# Altium schematic sheet Analog.SchDoc
size B
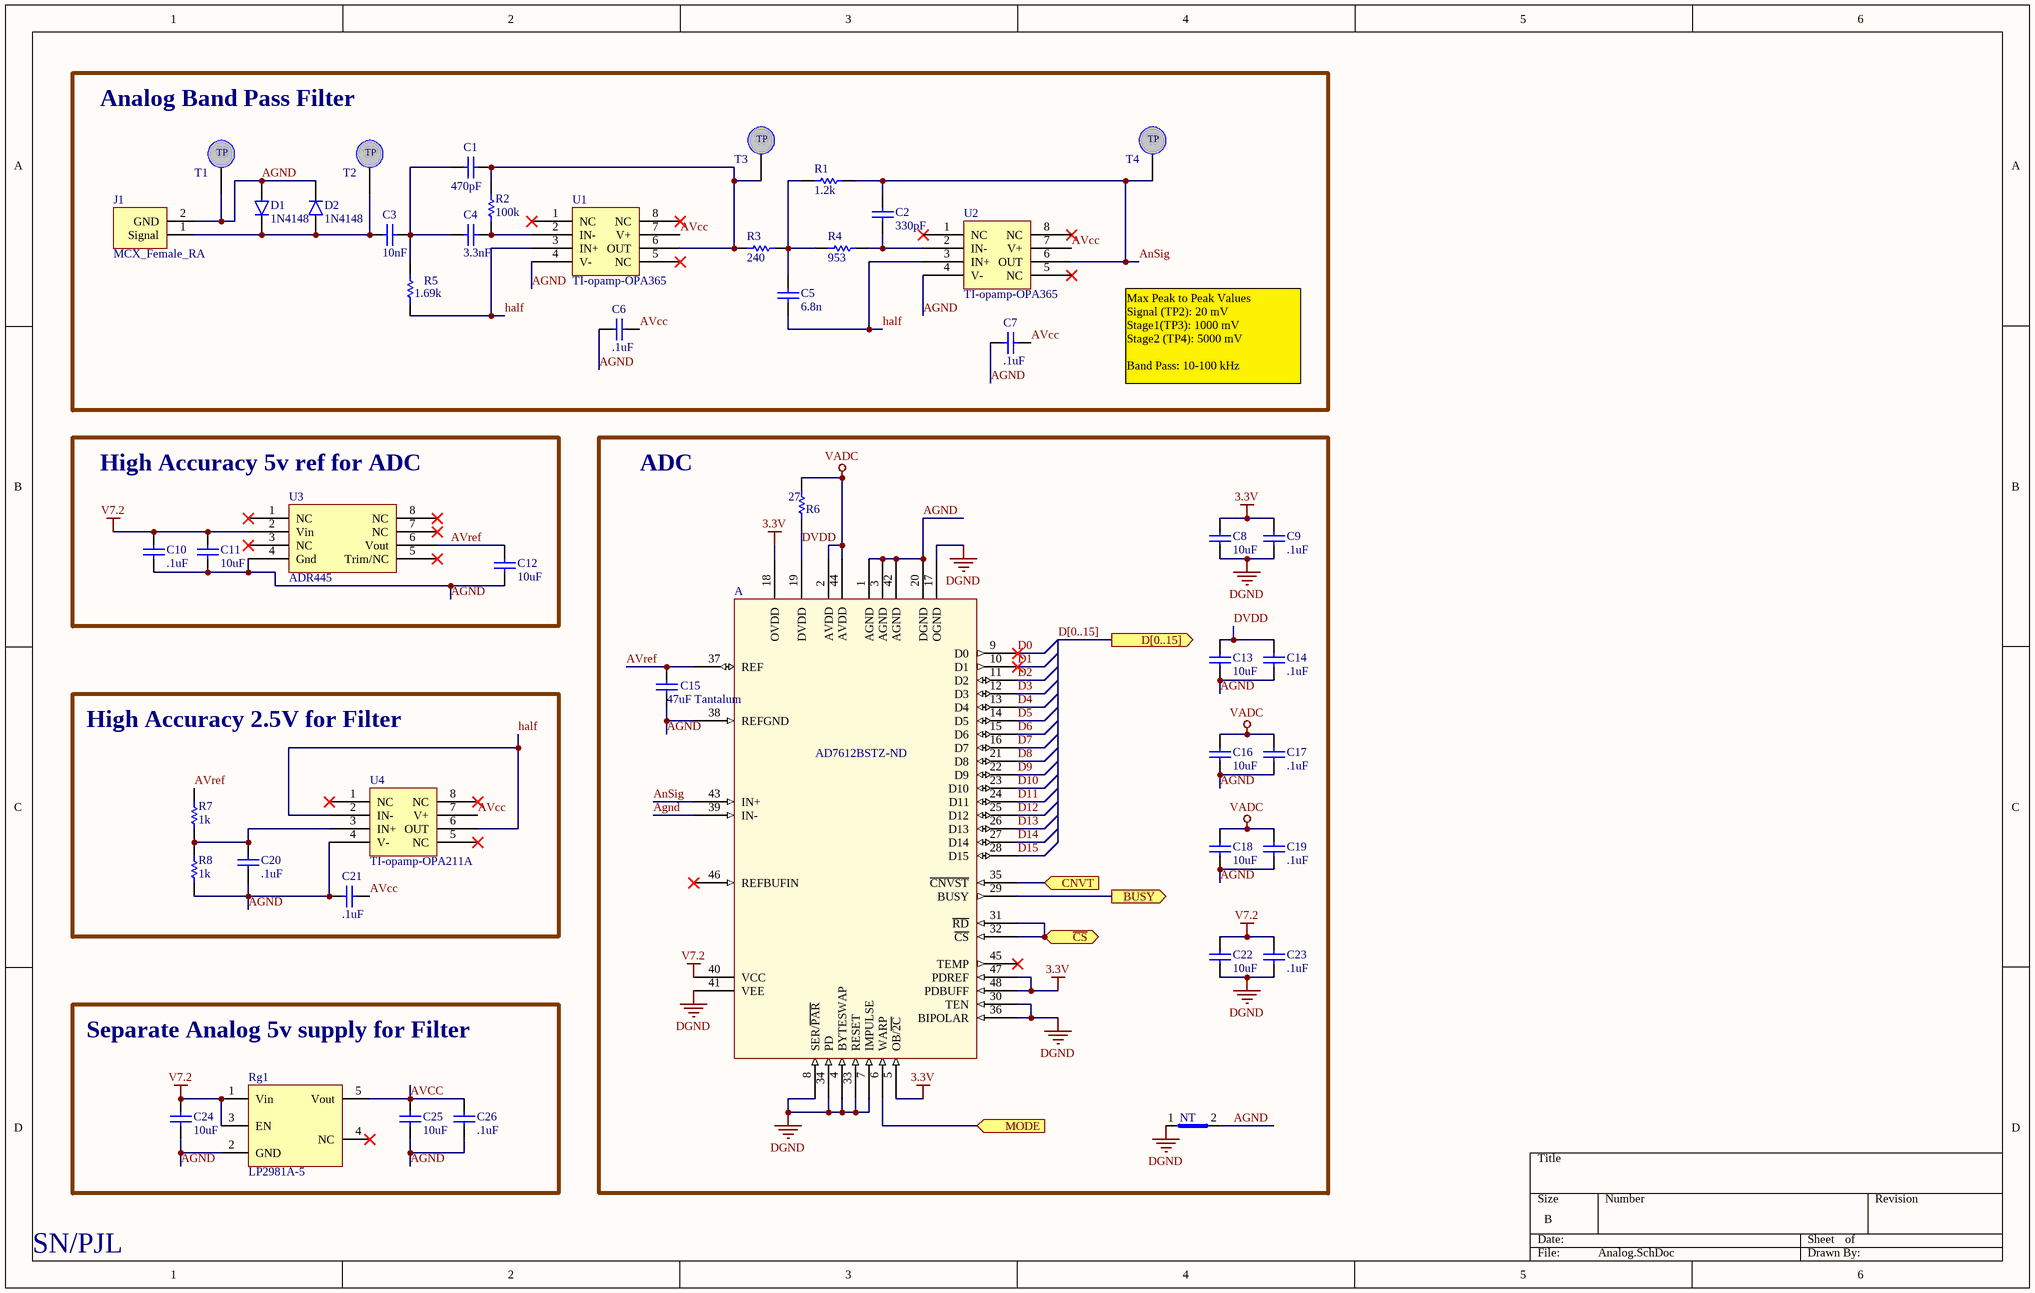
[diagram p0: Analog.SchDoc]

## Parts
A  Supplier Part Number: AD7612BSTZ-ND  [LQFP-48N - ADC]  (hidden comment: AD7612)
C1  470pF  [CAPC2012XN]
C2  330pF  [CAPC2012XN]
C3  10nF  [CAPC2012XN]
C4  3.3nF  [CAPC2012XN]
C5  6.8n  [CAPC2012XN]
C6  .1uF  [CAPC1608XN]
C7  .1uF  [CAPC1608XN]
C8  10uF  [CAPC2012XL]
C9  .1uF  [CAPC1608XN]
C10  .1uF  [CAPC1608XN]
C11  10uF  [CAPC2012XL]
C12  10uF  [CAPC2012XL]
C13  10uF  [CAPC2012XL]
C14  .1uF  [CAPC1608XN]
C15  47uF Tantalum  [CAPC2012XL]
C16  10uF  [CAPC2012XL]
C17  .1uF  [CAPC1608XN]
C18  10uF  [CAPC2012XL]
C19  .1uF  [CAPC1608XN]
C20  .1uF  [CAPC1608XN]
C21  .1uF  [CAPC1608XN]
C22  10uF  [CAPC2012XL]
C23  .1uF  [CAPC1608XN]
C24  10uF  [CAPC2012XL]
C25  10uF  [CAPC2012XL]
C26  .1uF  [CAPC1608XN]
D1  1N4148  [MCC-SOD123]
D2  1N4148  [MCC-SOD123]
J1  MCX_Female_RA  [MCX_Female]
NT  Net Tie SMT  [NetTie 35 mil]  (value not drawn)  (net tie, no BOM)
R1  1.2k  [RESC2012XN]
R2  100k  [RESC2012XN]
R3  240  [RESC2012XN]
R4  953  [RESC2012XN]
R5  1.69k  [RESC2012XN]
R6  27  [RESC2012XN]
R7  1k  [RESC2012XN]
R8  1k  [RESC2012XN]
Rg1  LP2981A-5  [TI-SOT-23_5N]
T1  TEST  [KEYSTONE-TEST-POINT]  (value not drawn)
T2  TEST  [KEYSTONE-TEST-POINT]  (value not drawn)
T3  TEST  [KEYSTONE-TEST-POINT]  (value not drawn)
T4  TEST  [KEYSTONE-TEST-POINT]  (value not drawn)
U1  TI-opamp-OPA365  [TI-SOIC1-8N]
U2  TI-opamp-OPA365  [TI-SOIC1-8N]
U3  ADR445  [TI-SOIC1-8N]
U4  TI-opamp-OPA211A  [TI-SOIC1-8N]

## Blocks framed on the sheet
Analog Band Pass Filter: C1-C7 D1 D2 J1 R1-R5 T1-T4 U1 U2
High Accuracy 5v ref for ADC: C10-C12 U3
ADC: A C8 C9 C13-C19 C22 C23 NT R6
High Accuracy 2.5V for Filter: C20 C21 R7 R8 U4
Separate Analog 5v supply for Filter: C24-C26 Rg1

## Ports
BUSY (out), CNVT (in), D[0..15] (out), MODE (in), ~{CS} (in)

## Nets
3.3V: A.5(OB/~{2C}) A.18(OVDD) A.47(PDREF) A.48(PDBUFF) C8.2 C9.2
DGND: A.4(BYTESWAP) A.7(IMPULSE) A.8(SER/~{PAR}) A.17(OGND) A.30(TEN) A.33(RESET) A.34(PD) A.36(BIPOLAR) A.41(VEE) C8.1 C9.1 C22.1 C23.1 NT.1(Net1)
V7.2: A.40(VCC) C10.1 C11.2 C22.2 C23.2 C24.2 Rg1.1(Vin) Rg1.3(EN) U3.2(Vin)
VADC: A.2(AVDD) A.44(AVDD) C16.2 C17.2 C18.2 C19.2 R6.2
Agnd: A.1(AGND) A.3(AGND) A.20(DGND) A.38(REFGND) A.39(IN-) A.42(AGND) C6.2 C7.1 C10.2 C11.1 C12.1 C13.1 C14.1 C15.1 C16.1 C17.1 C18.1 C19.1 C20.1 C21.2 C24.1 C25.1 C26.1 D1.1(Anode) D2.2(Cathode) J1.2(GND) NT.2(Net2) R8.2 Rg1.2(GND) T1.1 U1.4(V-) U2.4(V-) U3.4(Gnd) U4.4(V-)
AnSig: A.43(IN+) C2.1 R1.1 T4.1 U2.6(OUT)
AVcc: C6.1 C7.2 C21.1 C25.2 C26.2 Rg1.5(Vout) U1.7(V+) U2.7(V+) U4.7(V+)
AVref: A.37(REF) C12.2 C15.2 R7.1 U3.6(Vout)
BUSY: A.29(BUSY) ; port BUSY
~{CS}: A.31(~{RD}) A.32(~{CS}) ; port ~{CS}
CNVT: A.35(~{CNVST}) ; port CNVT
D0: A.9(D0)
D1: A.10(D1)
D2: A.11(D2)
D3: A.12(D3)
D4: A.13(D4)
D5: A.14(D5)
D6: A.15(D6)
D7: A.16(D7)
D8: A.21(D8)
D9: A.22(D9)
D10: A.23(D10)
D11: A.24(D11)
D12: A.25(D12)
D13: A.26(D13)
D14: A.27(D14)
D15: A.28(D15)
DVDD: A.19(DVDD) C13.2 C14.2 R6.1
half: C5.2 R5.1 U1.3(IN+) U2.3(IN+) U4.2(IN-) U4.6(OUT)
MODE: A.6(WARP) ; port MODE
NetC1_1: C1.1 C3.2 C4.1 R5.2
NetC1_2: C1.2 R2.1 R3.2 T3.1 U1.6(OUT)
NetC2_2: C2.2 R4.1 U2.2(IN-)
NetC3_1: C3.1 D1.2(Cathode) D2.1(Anode) J1.1(Signal) T2.1
NetC4_2: C4.2 R2.2 U1.2(IN-)
NetC5_1: C5.1 R1.2 R3.1 R4.2
NetC20_2: C20.2 R7.2 R8.1 U4.3(IN+)

Not connected (* = marked no-connect by the designer): A 45(TEMP)* 46(REFBUFIN)*; Rg1 4(NC)*; U1 1(NC)* 5(NC)* 8(NC)*; U2 1(NC)* 5(NC)* 8(NC)*; U3 1(NC)* 3(NC)* 5(Trim/NC)* 7(NC)* 8(NC)*; U4 1(NC)* 5(NC)* 8(NC)*

## Buses and harness runs
bus D[0..15] = port D[0..15]

## Notes on the sheet
- Max Peak to Peak Values
  Signal (TP2): 20 mV
  Stage1(TP3): 1000 mV
  Stage2 (TP4): 5000 mV
  Band Pass: 10-100 kHz
- SN/PJL
- (in symbol TEST-POINT) TP

## Library data of the parts
A = AD7623: Manufacturer Part Number: AD7612BSTZ; Manufacturer: Analog Devices Inc; Data Interface: Serial, Parallel; Sampling Rate (Per Second): 750k; Number of Bits: 16; Description: IC ADC 16BIT 750KSPS SAR 48-LQFP; Package / Case: 48-LQFP; Supplier: Digi-Key
C1 = CAP-CERAMIC-NP: Capacitor, Ceramic, Chip, Non-Polarized; Manufacturer Part Number: 08051A471FAT2A; Manufacturer: AVX Corporation; Voltage - Rated: 100V; Tolerance: ±1%; Description: CAP CER 470PF 100V 1% NP0 0805; Capacitance: 470pF; Package / Case: 0805 (2012 Metric); Supplier Part Number: 478-5272-1-ND; Supplier: Digi-Key
C2 = CAP-CERAMIC-NP: Capacitor, Ceramic, Chip, Non-Polarized; Manufacturer: AVX Corporation; Manufacturer Part Number: 08055A331FAT2A; Description: CAP CER 330PF 50V 1% NP0 0805; Voltage - Rated: 50V; Tolerance: ±1%; Supplier: Digi-Key; Supplier Part Number: 478-6045-1-ND; Thickness (Max): 0.037" (0.94mm); Capacitance: 330pF; Package / Case: 0805 (2012 Metric)
C3 = CAP-CERAMIC-NP: Capacitor, Ceramic, Chip, Non-Polarized; Manufacturer Part Number: GRM2195C1H103JA01D; Manufacturer: Murata Electronics North America; Tolerance: ±5%; Voltage Rating: ? V; Capacitance: 10000pF; Voltage - Rated: 50V; Description: CAP CER 10000PF 50V 5% NP0 0805; Supplier: Digi-Key; Supplier Part Number: 490-1642-1-ND; Package / Case: 0805 (2012 Metric)
C4 = CAP-CERAMIC-NP: Capacitor, Ceramic, Chip, Non-Polarized; Manufacturer: Murata Electronics North America; Manufacturer Part Number: GRM2165C1H332JA01D; Voltage - Rated: 50V; Capacitance: 3300pF; Tolerance: ±5%; Description: CAP CER 3300PF 50V 5% NP0 0805; Package / Case: 0805 (2012 Metric); Supplier Part Number: 490-1632-1-ND; Supplier: Digi-Key
C5 = CAP-CERAMIC-NP: CAP CER 6800PF 50V 5% NP0 0805; Manufacturer: Murata Electronics North America; Manufacturer Part Number: GRM2195C1H682JA01D; Supplier: Digi-Key; Supplier Part Number: 490-1638-1-ND; Voltage - Rated: 50V; Capacitance: 6800pF; Tolerance: ±5%; Package / Case: 0805 (2012 Metric)
C6 C7 C9 C10 C14 C17 C19-C21 C23 C26 = CAP-CERAMIC-NP: CAP CER 0.1UF 10V 20% X7R 0603; Manufacturer Part Number: CX0603MRX7R6BB104; Manufacturer: Yageo; Capacitance: 0.1µF; Applications: Bypass, Decoupling; Operating Temperature: -55°C ~ 125°C; Tolerance: ±20%; Package / Case: 0603 (1608 Metric); Voltage - Rated: 10V; Temperature Coefficient: X7R; Supplier Part Number: 311-1237-1-ND; Supplier: Digi-Key
C8 C11-C13 C16 C18 C22 C24 C25 = CAP-CERAMIC-NP: CAP CER 10UF 10V 10% X7R 0805; Manufacturer: Murata Electronics North America; Manufacturer Part Number: GRM21BR71A106KE51L; Capacitance: 10µF; Tolerance: ±10%; Operating Temperature: -55°C ~ 125°C; Supplier Part Number: 490-3905-1-ND; Supplier: Digi-Key; Voltage - Rated: 10V; Package / Case: 0805 (2012 Metric)
C15 = CAP-CERAMIC-NP: CAP TANT 47UF 10V 20% 0805; Manufacturer Part Number: TLJR476M010R3200; Manufacturer: AVX Corporation; ESR (Equivalent Series Resistance): 3.2 Ohm; Capacitance: 47µF; Package / Case: 0805 (2012 Metric); Supplier: Digi-Key; Supplier Part Number: 478-5990-1-ND; Tolerance: ±20%
D1 D2 = Diode - 1N4148W: DIODE SWITCH SS 75V 150MA SOD123; Manufacturer Part Number: 1N4148W-V-GS08; Manufacturer: Vishay Semiconductors; Speed: Small Signal =< 200mA (Io), Any Speed; Voltage - Forward (Vf) (Max) @ If: 1.2V @ 100mA; Diode Type: Standard; Supplier: Digi-Key; Package / Case: SOD-123; Supplier Device Package: SOD-123; Supplier Part Number: 1N4148W-V-GS08CT-ND; Current - Average Rectified (Io): 150mA; Voltage - DC Reverse (Vr) (Max): 75V
J1 = MCX_Female_RA: MCX female receptacle RA; Manufacturer Part Number: 1061023-1; Manufacturer: TE Connectivity; Frequency - Max: 6GHz; Impedance: 50 Ohm; Description: CONN JACK RCPT R/A 50 OHM NICKEL; Fastening Type: Snap-On; Mounting Type: Through Hole, Right Angle; Supplier Part Number: A98546-ND; Connector Style: MCX; Supplier: Digi-Key
NT = NetTie: Net-Tie, Surface Mount
R1 = RES-CHIP: RES 1.2K OHM .1% 1/4W 0805 SMD; Manufacturer Part Number: RG2012P-122-B-T5; Manufacturer: Susumu; Description: RES 1.2K OHM 1/8W .1% 0805 SMD; Power (Watts): 0.125W, 1/8W; Tolerance: ±0.1%; Supplier Part Number: RG20P1.2KBCT-ND; Resistance (Ohms): 1.2k; Supplier: Digi-Key; Package / Case: 0805 (2012 Metric)
R2 = RES-CHIP: RES PREC 100K OHM 250MW .1% 0805; Manufacturer Part Number: PFC-W0805LF-03-1003-B-1739; Manufacturer: TT Electronics/IRC; Temperature Coefficient: ±25ppm/°C; Tolerance: ±0.1%; Supplier Part Number: 989-1134-1-ND; Supplier: Digi-Key; Resistance (Ohms): 100k; Package / Case: 0805 (2012 Metric)
R3 = RES-CHIP: Resistor Chip; Manufacturer: Susumu; Manufacturer Part Number: RG2012P-241-B-T5; Tolerance: ±0.1%; Power (Watts): 0.125W, 1/8W; Description: RES 240 OHM 1/8W .1% 0805 SMD; Resistance (Ohms): 240; Package / Case: 0805 (2012 Metric); Supplier Part Number: RG20P240BCT-ND; Supplier: Digi-Key
R4 = RES-CHIP: Resistor Chip; Manufacturer: Panasonic Electronic Components; Manufacturer Part Number: ERA-6AEB9530V; Tolerance: ±0.1%; Description: RES 953 OHM 1/8W .1% 0805 SMD; Power (Watts): 0.125W, 1/8W; Supplier Part Number: P953DACT-ND; Resistance (Ohms): 953; Supplier: Digi-Key; Package / Case: 0805 (2012 Metric)
R5 = RES-CHIP: RES 1.69K OHM 1/8W .1% 0805 SMD; Manufacturer: Susumu; Manufacturer Part Number: RG2012P-1691-B-T5; Tolerance: ±0.1%; Power (Watts): 0.125W, 1/8W; Package / Case: 0805 (2012 Metric); Resistance (Ohms): 1.69k; Supplier Part Number: RG20P1.69KBCT-ND; Supplier: Digi-Key
R6 = Resistor: Manufacturer Part Number: ESR10EZPJ270; Manufacturer: Rohm Semiconductor; Power (Watts): 0.25W, 1/4W; Tolerance: ±5%; Description: RES 27 OHM 1/4W 5% 0805 SMD; Package / Case: 0805 (2012 Metric); Supplier Part Number: RHM27KCT-ND; Resistance (Ohms): 27; Supplier: Digi-Key
R7 R8 = RES-CHIP: Resistor Chip; Manufacturer: Susumu; Manufacturer Part Number: RGH2012-2E-P-102-B; Description: RES 1.0K OHM .1% 1/4W 0805 SMD; Power (Watts): 0.25W, 1/4W; Tolerance: ±0.1%; Supplier: Digi-Key; Supplier Part Number: RGH20P1.0KBCT-ND; Resistance (Ohms): 1k; Package / Case: 0805 (2012 Metric)
Rg1 = LP2981A: 100mA 5v LDO - 0.75% accuracy; Manufacturer: Texas Instruments; Manufacturer Part Number: LP2981A-50DBVT; Description: IC REG LDO 5V .1A SOT23-5; Voltage - Input: Up to 16V; Current - Output: 100mA (Max); Voltage - Dropout (Typical): 0.2V @ 100mA; Supplier Part Number: 296-32146-1-ND; Supplier: Digi-Key; Operating Temperature: -40°C ~ 125°C; Supplier Device Package: SOT-23-5; Voltage - Output: 5V
T1 = TEST-POINT: Single pin, looped test point --- 0.063" (1.600mm) Hole Diameter; Manufacturer: Keystone Electronics; Manufacturer Part Number: 5006; Color: Black; Description: TEST POINT PC COMPACT .063"D BLK; Supplier Part Number: 5006K-ND; Supplier: Digi-Key
T2-T4 = TEST-POINT: Single pin, looped test point --- 0.063" (1.600mm) Hole Diameter; Manufacturer Part Number: 5006; Manufacturer: Keystone Electronics; Color: Black; Description: TEST POINT PC COMPACT .063"D BLK; Mounting Type: 0.063" (1.60mm) Hole Diameter; Supplier: Digi-Key; Supplier Part Number: 5006K-ND
U1 U2 = TI-opamp-OPA365: Manufacturer Part Number: OPA365AID; Manufacturer: Texas Instruments; Voltage - Supply, Single/Dual (±): 2.2 V ~ 5.5 V, ±1.1 V ~ 2.25 V; Current - Output / Channel: 65mA; Amplifier Type: General Purpose; Voltage - Input Offset: 100µV; Number of Circuits: 1; Gain Bandwidth Product: 50MHz; Output Type: Rail-to-Rail; Description: IC OPAMP GP R-R 50MHZ SGL 8SOIC; Supplier Part Number: 296-21235-5-ND; Supplier: Digi-Key; Package / Case: 8-SOIC (0.154", 3.90mm Width)
U3 = ADR445: Ultralow Noise, LDO XFET Voltage   References with Current Sink and Source; Manufacturer Part Number: ADR445BRZ; Manufacturer: Analog Devices Inc; Description: IC VREF SERIES PREC 5V 8-SOIC; Voltage - Output: 5V; Voltage - Input: 5.5 V ~ 18 V; Current - Output: 10mA; Tolerance: ±0.04%; Supplier Device Package: 8-SOIC N; Package / Case: 8-SOIC (0.154", 3.90mm Width); Supplier: Digi-Key; Supplier Part Number: ADR445BRZ-ND
U4 = TI-opamp-OPA211A: IC OPAMP GP R-R 80MHZ SGL 8SOIC; Manufacturer Part Number: OPA211AIDR; Manufacturer: Texas Instruments; Voltage - Supply, Single/Dual (±): 4.5 V ~ 36 V, ±2.25 V ~ 18 V; Output Type: Rail-to-Rail; Current - Output / Channel: 30mA; Supplier: Digi-Key; Supplier Device Package: 8-SOIC; Package / Case: 8-SOIC (0.154", 3.90mm Width); Supplier Part Number: 296-22634-1-ND; Gain Bandwidth Product: 80MHz